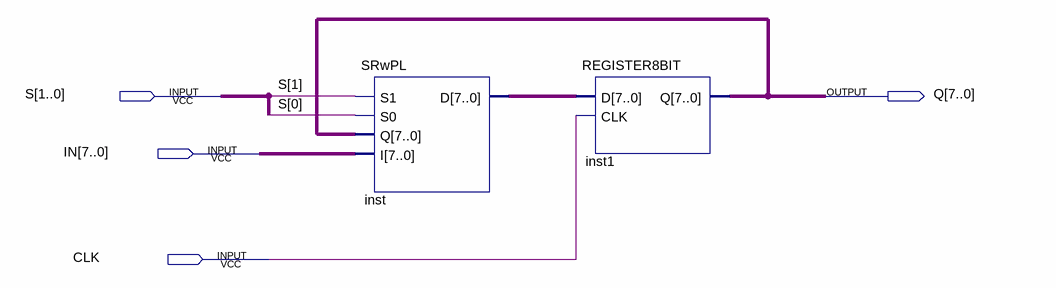
[diagram p0: schematic sheet]
// Quartus schematic SRwPL1.bdf as structural Verilog: 2 symbols, 4 pins
module SRwPL1 (
  input  [1:0] S,
  input  [7:0] IN,
  input  CLK,
  output [7:0] Q
);

  wire [7:0] inst_d;

  SRwPL inst (.S1(S[1]), .S0(S[0]), .Q(Q), .I(IN), .D(inst_d));
  REGISTER8BIT inst1 (.D(inst_d), .CLK(CLK), .Q(Q));
endmodule
